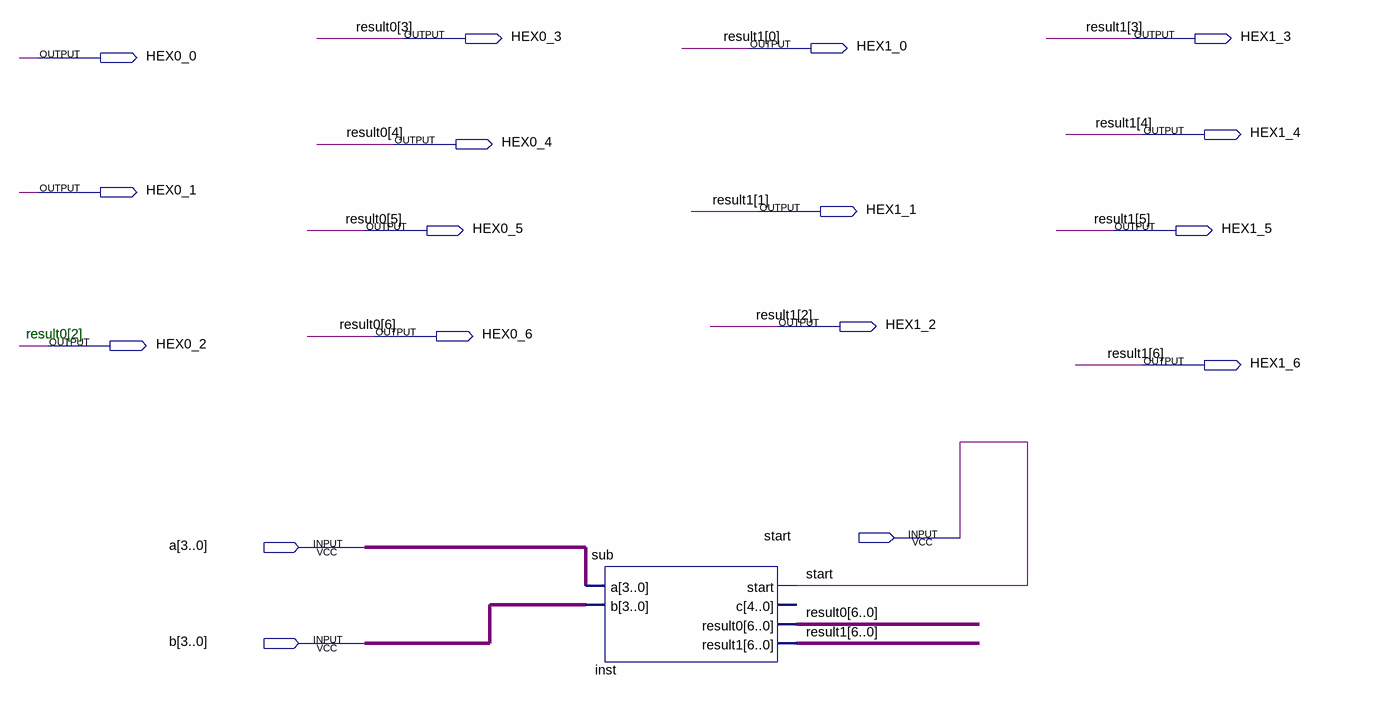
[diagram p0: schematic sheet]
// Quartus schematic subtract.bdf as structural Verilog: 1 symbols, 17 pins
module subtract (
  input  start,
  input  [3:0] a,
  input  [3:0] b,
  output HEX0_3,
  output HEX1_3,
  output HEX1_0,
  output HEX0_0,
  output HEX1_4,
  output HEX0_4,
  output HEX0_1,
  output HEX1_1,
  output HEX0_5,
  output HEX1_5,
  output HEX1_2,
  output HEX0_6,
  output HEX0_2,
  output HEX1_6
);

  wire [1:0] result0;

  sub inst (
    .a(a), .b(b), .result0({HEX0_6, HEX0_5, HEX0_4, HEX0_3, HEX0_2, result0}),
    .result1({HEX1_6, HEX1_5, HEX1_4, HEX1_3, HEX1_2, HEX1_1, HEX1_0}), .start(start));  // open: c

  // Other names for the same wires on the sheet: result0[6:2] = {HEX0_6, HEX0_5, HEX0_4, HEX0_3, HEX0_2};
  //   result1[6:0] = {HEX1_6, HEX1_5, HEX1_4, HEX1_3, HEX1_2, HEX1_1, HEX1_0}

  // Notes on the sheet:
  //   result0[2]
endmodule
